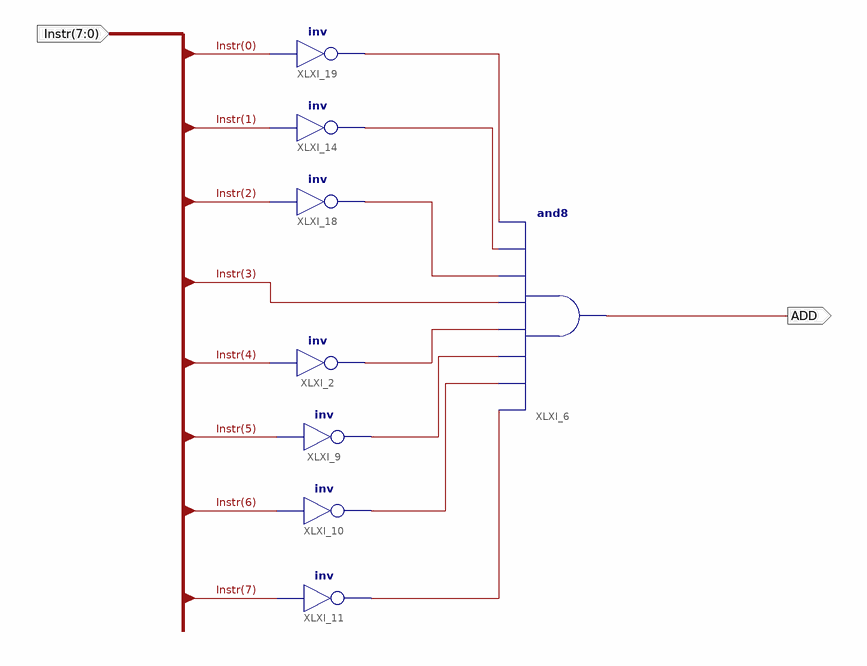
[diagram p0: schematic sheet 1]
// Xilinx ISE schematic instrADDU.sch (spartan3e) as structural Verilog: 8 symbols, 2 ports
module instrADDU (
  input  [7:0] Instr,
  output ADD
);

  wire XLXN_3, XLXN_4, XLXN_5, XLXN_10, XLXN_11, XLXN_14, XLXN_15;

  not XLXI_2 (XLXN_3, Instr[4]);
  not XLXI_9 (XLXN_4, Instr[5]);
  not XLXI_10 (XLXN_5, Instr[6]);
  not XLXI_11 (XLXN_10, Instr[7]);
  and XLXI_6 (ADD, XLXN_10, XLXN_5, XLXN_4, XLXN_3, Instr[3], XLXN_15, XLXN_11, XLXN_14);
  not XLXI_14 (XLXN_11, Instr[1]);
  not XLXI_18 (XLXN_15, Instr[2]);
  not XLXI_19 (XLXN_14, Instr[0]);
endmodule
